# Altium schematic sheet STM32H730_PINOUT.SchDoc
size C; SheetNumber: 4; SheetTotal: 9
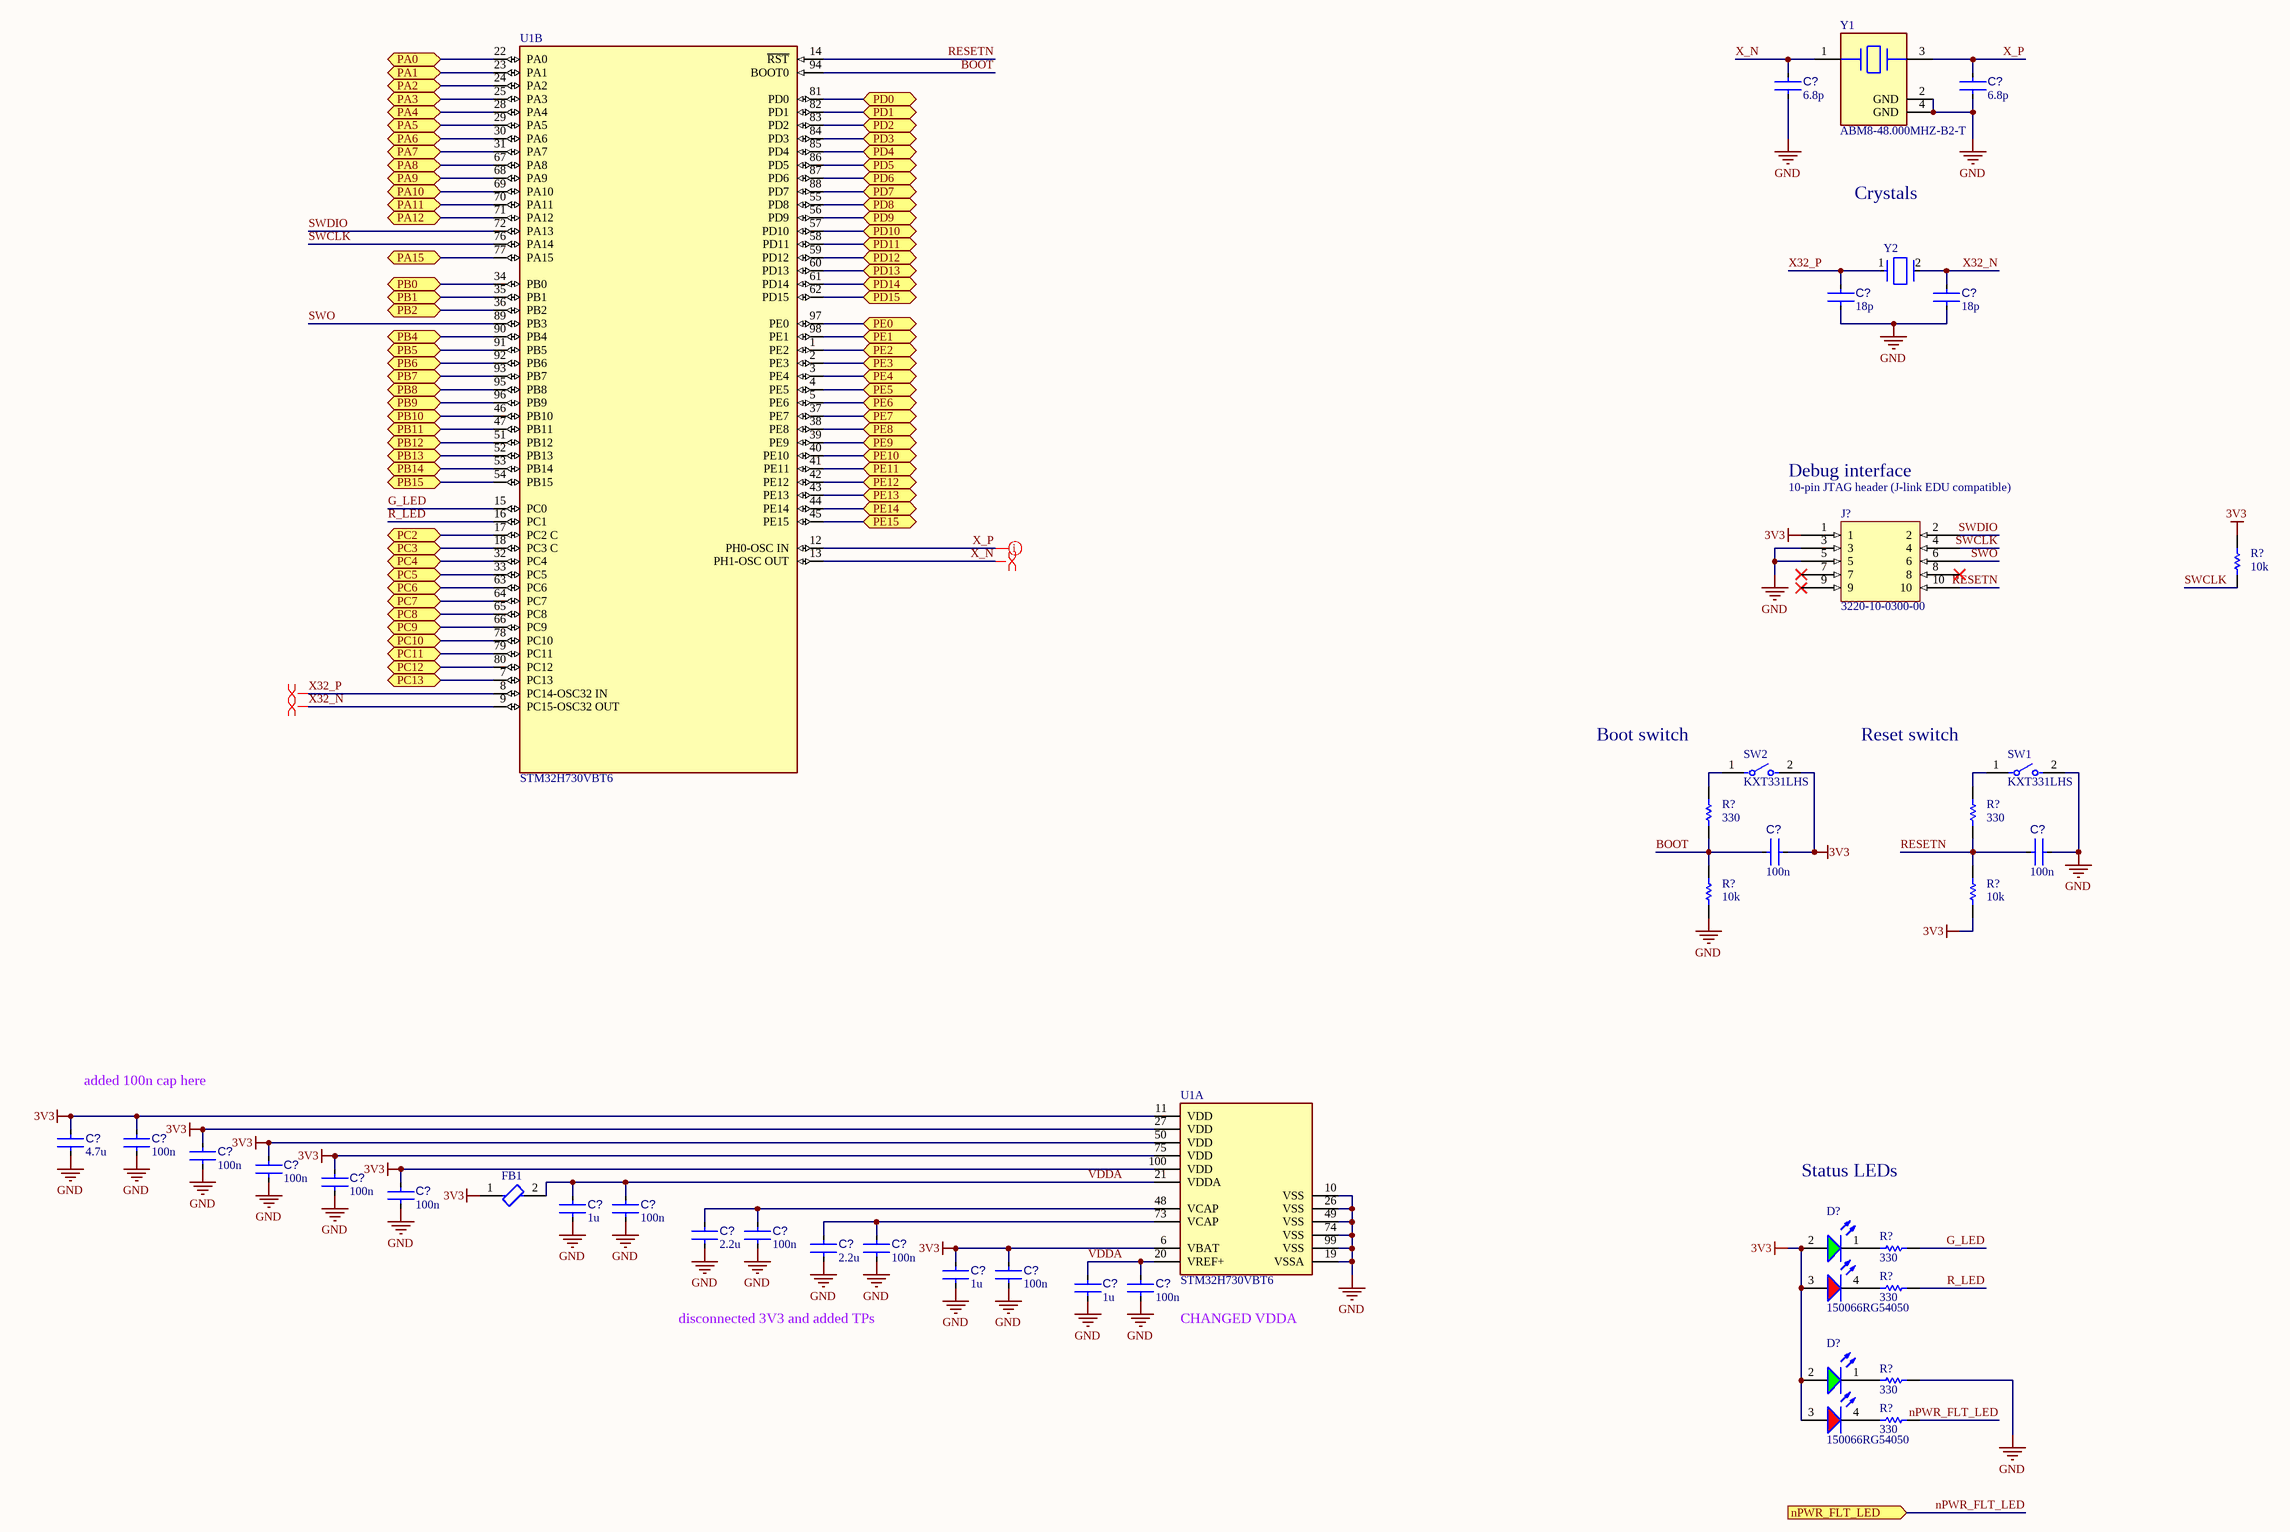
[diagram p0: STM32H730_PINOUT.SchDoc]

## Parts
(Parts that share a designator on the sheet are numbered #1, #2 ... from top to bottom, then left to right.)
C?#1  6.8p  [C0402B]
C?#2  6.8p  [C0402B]
C?#3  18p  [C0402B]
C?#4  18p  [C0402B]
C?#5  100n  [C0402B]
C?#6  100n  [C0402B]
C?#7  4.7u  [C0402B]
C?#8  100n  [C0402B]
C?#9  100n  [C0402B]
C?#10  100n  [C0402B]
C?#11  100n  [C0402B]
C?#12  100n  [C0402B]
C?#13  1u  [C0402B]
C?#14  100n  [C0402B]
C?#15  2.2u  [C0402B]
C?#16  100n  [C0402B]
C?#17  2.2u  [C0402B]
C?#18  100n  [C0402B]
C?#19  1u  [C0402B]
C?#20  100n  [C0402B]
C?#21  1u  [C0402B]
C?#22  100n  [C0402B]
D?#1  150066RG54050  [WL-SBCD_0606]
D?#2  150066RG54050  [WL-SBCD_0606]
FB1  BLM15PX601SN1D  [FP-BLM15-0_05-IPC_A]  (value not drawn)
J?  3220-10-0300-00  [3220-10-0300-00-Footprint-1]
R?#1  10k  [R0603B]
R?#2  330  [R0603B]
R?#3  330  [R0603B]
R?#4  10k  [R0603B]
R?#5  10k  [R0603B]
R?#6  330  [R0603B]
R?#7  330  [R0603B]
R?#8  330  [R0603B]
R?#9  330  [R0603B]
SW1  KXT331LHS  [FP-KXT331LHS-MFG]
SW2  KXT331LHS  [FP-KXT331LHS-MFG]
U1  STM32H730VBT6  [FP-LQFP100-1L-IPC_C]  (parts A,B of 2)
Y1  ABM8-48.000MHZ-B2-T  [FP-ABM8-MFG]
Y2  ECS-.327-12.5-1210-TR  [FP-ECX-1210-MFG]  (value not drawn)

## Ports
nPWR_FLT_LED (in), PA0 (bidir), PA1 (bidir), PA2 (bidir), PA3 (bidir), PA4 (bidir), PA5 (bidir), PA6 (bidir), PA7 (bidir), PA8 (bidir), PA9 (bidir), PA10 (bidir), PA11 (bidir), PA12 (bidir), PA15 (bidir), PB0 (bidir), PB1 (bidir), PB2 (bidir), PB4 (bidir), PB5 (bidir), PB6 (bidir), PB7 (bidir), PB8 (bidir), PB9 (bidir), PB10 (bidir), PB11 (bidir), PB12 (bidir), PB13 (bidir), PB14 (bidir), PB15 (bidir), PC2 (bidir), PC3 (bidir), PC4 (bidir), PC5 (bidir), PC6 (bidir), PC7 (bidir), PC8 (bidir), PC9 (bidir), PC10 (bidir), PC11 (bidir), PC12 (bidir), PC13 (bidir), PD0 (bidir), PD1 (bidir), PD2 (bidir), PD3 (bidir), PD4 (bidir), PD5 (bidir), PD6 (bidir), PD7 (bidir), PD8 (bidir), PD9 (bidir), PD10 (bidir), PD11 (bidir), PD12 (bidir), PD13 (bidir), PD14 (bidir), PD15 (bidir), PE0 (bidir), PE1 (bidir), PE2 (bidir), PE3 (bidir), PE4 (bidir), PE5 (bidir), PE6 (bidir), PE7 (bidir), PE8 (bidir), PE9 (bidir), PE10 (bidir), PE11 (bidir), PE12 (bidir), PE13 (bidir), PE14 (bidir), PE15 (bidir)

## Nets
3V3: C?#5.1 C?#7.2 C?#8.2 C?#9.2 C?#10.2 C?#11.2 C?#12.2 C?#19.2 C?#20.2 D?#1.2(A) D?#1.3(A) D?#2.2(A) D?#2.3(A) FB1.1 J?.1 R?#1.2 R?#5.1 SW2.2 U1.6(VBAT) U1.11(VDD) U1.27(VDD) U1.50(VDD) U1.75(VDD) U1.100(VDD)
GND: C?#1.1 C?#2.1 C?#3.1 C?#4.1 C?#6.1 C?#7.1 C?#8.1 C?#9.1 C?#10.1 C?#11.1 C?#12.1 C?#13.1 C?#14.1 C?#15.1 C?#16.1 C?#17.1 C?#18.1 C?#19.1 C?#20.1 C?#21.1 C?#22.1 J?.3 J?.5 R?#4.1 R?#8.1 SW1.2 U1.10(VSS) U1.19(VSSA) U1.26(VSS) U1.49(VSS) U1.74(VSS) U1.99(VSS) Y1.2(GND) Y1.4(GND)
BOOT: C?#5.2 R?#2.1 R?#4.2 U1.94(BOOT0)
G_LED: R?#6.1 U1.15(PC0)
nPWR_FLT_LED: R?#9.1 ; port nPWR_FLT_LED
PA0: U1.22(PA0) ; port PA0
PA1: U1.23(PA1) ; port PA1
PA2: U1.24(PA2) ; port PA2
PA3: U1.25(PA3) ; port PA3
PA4: U1.28(PA4) ; port PA4
PA5: U1.29(PA5) ; port PA5
PA6: U1.30(PA6) ; port PA6
PA7: U1.31(PA7) ; port PA7
PA8: U1.67(PA8) ; port PA8
PA9: U1.68(PA9) ; port PA9
PA10: U1.69(PA10) ; port PA10
PA11: U1.70(PA11) ; port PA11
PA12: U1.71(PA12) ; port PA12
PA15: U1.77(PA15) ; port PA15
PB0: U1.34(PB0) ; port PB0
PB1: U1.35(PB1) ; port PB1
PB2: U1.36(PB2) ; port PB2
PB4: U1.90(PB4) ; port PB4
PB5: U1.91(PB5) ; port PB5
PB6: U1.92(PB6) ; port PB6
PB7: U1.93(PB7) ; port PB7
PB8: U1.95(PB8) ; port PB8
PB9: U1.96(PB9) ; port PB9
PB10: U1.46(PB10) ; port PB10
PB11: U1.47(PB11) ; port PB11
PB12: U1.51(PB12) ; port PB12
PB13: U1.52(PB13) ; port PB13
PB14: U1.53(PB14) ; port PB14
PB15: U1.54(PB15) ; port PB15
PC2: U1.17(PC2_C) ; port PC2
PC3: U1.18(PC3_C) ; port PC3
PC4: U1.32(PC4) ; port PC4
PC5: U1.33(PC5) ; port PC5
PC6: U1.63(PC6) ; port PC6
PC7: U1.64(PC7) ; port PC7
PC8: U1.65(PC8) ; port PC8
PC9: U1.66(PC9) ; port PC9
PC10: U1.78(PC10) ; port PC10
PC11: U1.79(PC11) ; port PC11
PC12: U1.80(PC12) ; port PC12
PC13: U1.7(PC13) ; port PC13
PD0: U1.81(PD0) ; port PD0
PD1: U1.82(PD1) ; port PD1
PD2: U1.83(PD2) ; port PD2
PD3: U1.84(PD3) ; port PD3
PD4: U1.85(PD4) ; port PD4
PD5: U1.86(PD5) ; port PD5
PD6: U1.87(PD6) ; port PD6
PD7: U1.88(PD7) ; port PD7
PD8: U1.55(PD8) ; port PD8
PD9: U1.56(PD9) ; port PD9
PD10: U1.57(PD10) ; port PD10
PD11: U1.58(PD11) ; port PD11
PD12: U1.59(PD12) ; port PD12
PD13: U1.60(PD13) ; port PD13
PD14: U1.61(PD14) ; port PD14
PD15: U1.62(PD15) ; port PD15
PE0: U1.97(PE0) ; port PE0
PE1: U1.98(PE1) ; port PE1
PE2: U1.1(PE2) ; port PE2
PE3: U1.2(PE3) ; port PE3
PE4: U1.3(PE4) ; port PE4
PE5: U1.4(PE5) ; port PE5
PE6: U1.5(PE6) ; port PE6
PE7: U1.37(PE7) ; port PE7
PE8: U1.38(PE8) ; port PE8
PE9: U1.39(PE9) ; port PE9
PE10: U1.40(PE10) ; port PE10
PE11: U1.41(PE11) ; port PE11
PE12: U1.42(PE12) ; port PE12
PE13: U1.43(PE13) ; port PE13
PE14: U1.44(PE14) ; port PE14
PE15: U1.45(PE15) ; port PE15
R_LED: R?#7.1 U1.16(PC1)
RESETN: C?#6.2 J?.10 R?#3.1 R?#5.2 U1.14(~{RST})
SWCLK: J?.4 R?#1.1 U1.76(PA14)
SWDIO: J?.2 U1.72(PA13)
SWO: J?.6 U1.89(PB3)
VDDA: C?#13.2 C?#14.2 C?#21.2 C?#22.2 FB1.2 U1.20(VREF+) U1.21(VDDA)
X32_N: C?#4.2 U1.9(PC15-OSC32_OUT) Y2.2(Out/In)
X32_P: C?#3.2 U1.8(PC14-OSC32_IN) Y2.1(In/Out)
X_N: C?#1.2 U1.13(PH1-OSC_OUT) Y1.1
X_P: C?#2.2 U1.12(PH0-OSC_IN) Y1.3
NetC?#15_2: C?#15.2 C?#16.2 U1.48(VCAP)
NetC?#17_2: C?#17.2 C?#18.2 U1.73(VCAP)
NetD?#1_1: D?#1.1(K) R?#6.2
NetD?#1_4: D?#1.4(K) R?#7.2
NetD?#2_1: D?#2.1(K) R?#8.2
NetD?#2_4: D?#2.4(K) R?#9.2
NetR?#2_2: R?#2.2 SW2.1
NetR?#3_2: R?#3.2 SW1.1

Not connected (* = marked no-connect by the designer): J? 7* 8* 9*

## Layout directives
differential pair: X32_N, X32_P, X_N, X_P

## Notes on the sheet
- Crystals
- Debug interface
- (near J?) 10-pin JTAG header (J-link EDU compatible)
- Boot switch
- Reset switch
- (near C?#8) added 100n cap here
- Status LEDs
- disconnected 3V3 and added TPs
- CHANGED VDDA

## Library data of the parts
C?#1-C?#22 = CMP-001-00000-11: Non-polarized capacitor
D?#1 D?#2 = CMP-004-00040-2: Led, Red/Grn, 180Mcd/230Mcd, 624Nm/525Nm Rohs Compliant: Yes; Source: rgled.SchLib; Component Type: Standard; Design Item ID: CMP-004-00034-2; Pins: 4
FB1 = CMP-0686-00252-4: Chip Ferrite Bead, 0402, 600Ω @ 100MHz, 0.23Ω, 25%, 900mA; Number of Circuits: 1; Impedance: 600R; DC Resistance (DCR): 230mR; Material: Steel; Length: 1mm; Package Quantity: 10000; Height: 0.5mm; Width: 0.5mm; Max DC Current: 900mA; Number of Lines: 1; Termination: SMD/SMT; Packaging: Tape and Reel; Lead Free: Lead Free; Min Operating Temperature: -55°C; Max Operating Temperature: 125°C; Max Current Rating: 900mA; Case Code (Imperial): 0402; Number of Pins: 2; Current Rating: 900mA; Test Frequency: 100MHz; Case/Package: 0402; Tolerance: 25%; Case Code (Metric): 1005
J? = CMP-001-0013-3: CONN HEADER SMD 10POS 1.27MM
R?#1-R?#9 = CMP-009-00002-14: Resistor
  R?#1 R?#4 R?#5: Value: 10k
  R?#2 R?#3 R?#6-R?#9: Value: 330
SW1 SW2 = CMP-10040-000029-1: SWITCH TACTILE SPST-NO 0.02A 15V; Operating Force: 240gf; Switch Travel: 0.13mm; Illumination Type: Non-Illuminated; Throw Configuration: SPST; Number of Ports: 1; Current Rating: 5A; Mechanical Life: 500000Cycles; Switch Function: Off-Mom; Connector Type: USB; Actuator Type: Standard; Gender: Receptacle; Number of Contacts: 24; Contact Plating: Gold; Insulation Color: Black; Min Operating Temperature: -40°C; Packaging: Tape and Reel; Flammability Rating: UL94 V-0; Max Operating Temperature: 85°C; Termination: Solder; Mount: Surface Mount
U1 = CMP-12105-000107-1: IC MCU 32BIT 128KB FLASH 100LQFP
Y1 = CMP-27762-011708-1: Crystal 48MHz ±20ppm 18pF SMD-4 3.2mm x 2.5mm; Series Resistance: 35R; Frequency Stability: 50ppm; Package Quantity: 1000; Packaging: Tape and Reel; Mount: Surface Mount; Length: 3.2mm; Load Capacitance: 18pF; Max Operating Temperature: 70°C; Operating Frequency: 48 MHz; RoHS Compliant: Yes; Series: ABM8; Frequency Tolerance: 20ppm; Lead Free: Lead Free; Min Operating Temperature: -20°C; Case/Package: CSMD; Number of Pins: 4; Height: 0.031inch; ESR (Equivalent Series Resistance): 35R; Frequency: 48MHz; Radiation Hardening: No; Width: 0.098inch; Tolerance: 20ppm; Termination: SMD/SMT; Depth: 2.5mm; Resistor Type: Ceramic; REACH SVHC: No SVHC
Y2 = CMP-40224-000006-1: CRYSTAL 32.7680KHZ 12.5PF SMD; Manufacturer: ECS International; Frequency: 32.768kHz; Esr: 90kΩ; Tolerance: 20ppm; Device Class L1: Passive Components; Load Capacitance: 12.5pF; Temperature: -40°C to +85°C; ComponentLink2URL: https://ecsxtal.com/store/pdf/ECX-1210.pdf; Series: ECX-1210; Octopart: https://octopart.com/ecs-.327-12.5-1210-tr-ecs+international-81221340; ComponentLink2Description: Datasheet; Temperature Range Low: -40°C; Digikey Description: CRYSTAL 32.7680KHZ 12.5PF SMD; Lead Free: Yes; RoHS: TRUE; Device Class L3: Crystals; Automotive: No; Category: Crys; Height: 0.5mm; Manufacturer Part Number: ECS-.327-12.5-1210-TR; Temperature Range High: +85°C; Device Class L2: Crystals / Oscillators; Package: ECX-1210